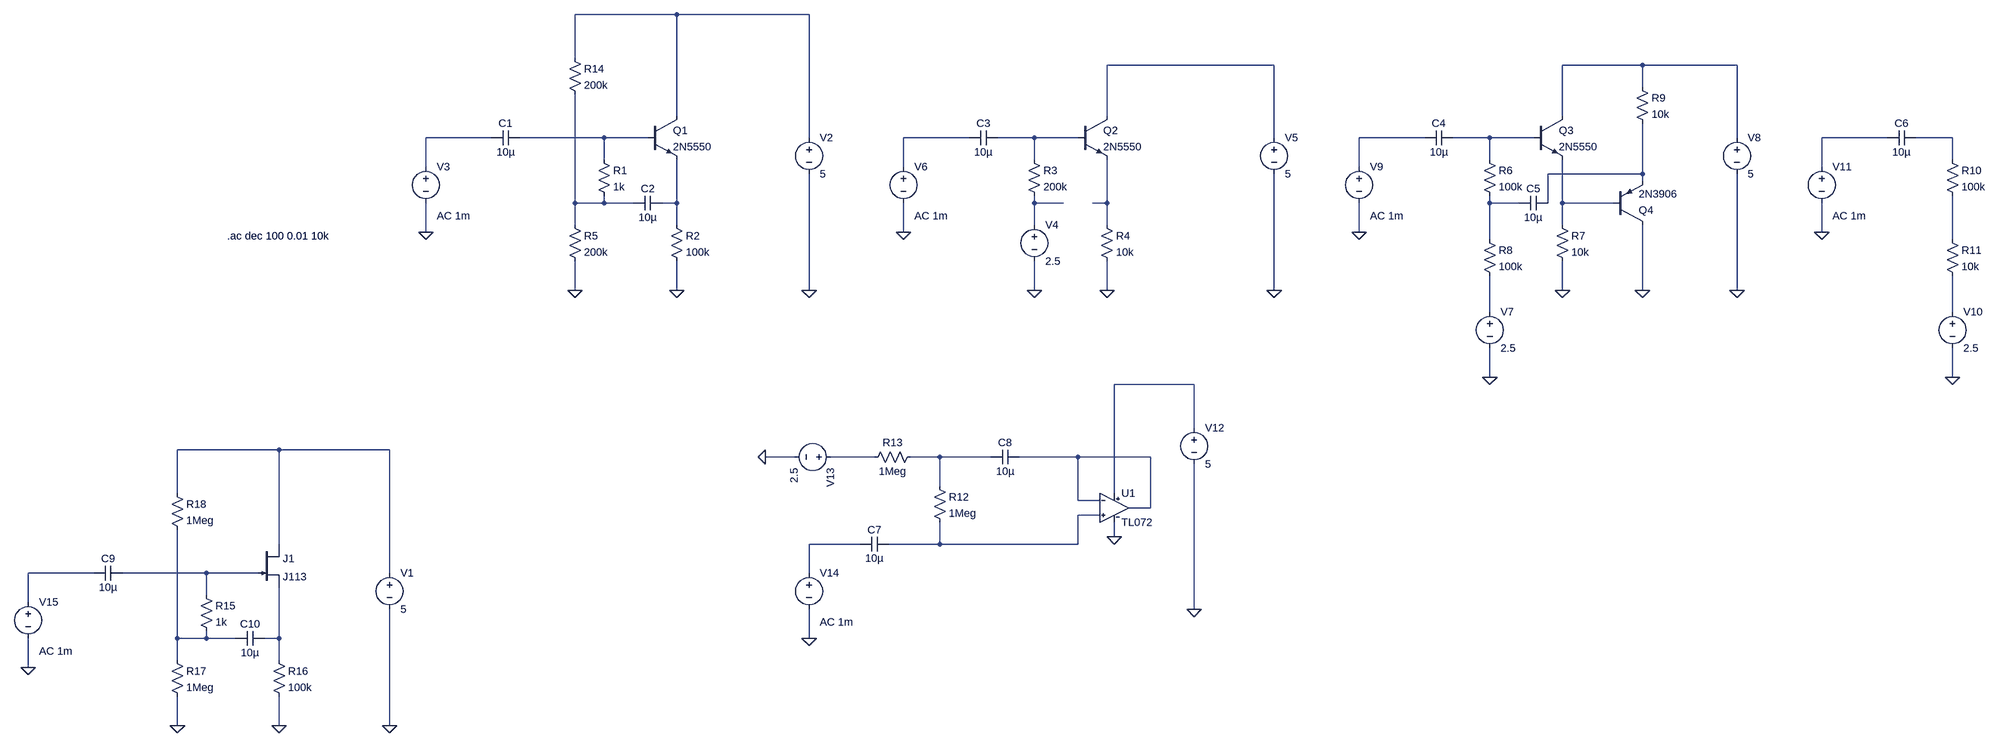
[diagram p0: schematic bootstrapped_input.asc]
bootstrapped_input.asc, the LTspice schematic file:
Version 4
SHEET 1 3344 1524
WIRE 208 -64 -16 -64
WIRE 576 -64 208 -64
WIRE -16 32 -16 -64
WIRE 1600 48 1232 48
WIRE 2416 48 2240 48
WIRE 2736 48 2416 48
WIRE 2416 96 2416 48
WIRE 208 160 208 -64
WIRE 1232 160 1232 48
WIRE 2240 160 2240 48
WIRE -224 208 -368 208
WIRE 48 208 -160 208
WIRE 144 208 48 208
WIRE 576 208 576 -64
WIRE 928 208 784 208
WIRE 1072 208 992 208
WIRE 1168 208 1072 208
WIRE 1600 208 1600 48
WIRE 1936 208 1792 208
WIRE 2080 208 2000 208
WIRE 2176 208 2080 208
WIRE 2736 208 2736 48
WIRE 3120 208 2976 208
WIRE 3264 208 3184 208
WIRE 48 256 48 208
WIRE 1072 256 1072 208
WIRE 2080 256 2080 208
WIRE 3264 256 3264 208
WIRE -368 272 -368 208
WIRE 784 272 784 208
WIRE 1792 272 1792 208
WIRE 2976 272 2976 208
WIRE 2416 288 2416 176
WIRE 2416 288 2208 288
WIRE 2416 304 2416 288
WIRE -16 352 -16 112
WIRE 48 352 48 336
WIRE 48 352 -16 352
WIRE 112 352 48 352
WIRE 208 352 208 256
WIRE 208 352 176 352
WIRE 1072 352 1072 336
WIRE 1136 352 1072 352
WIRE 1232 352 1232 256
WIRE 1232 352 1200 352
WIRE 2080 352 2080 336
WIRE 2144 352 2080 352
WIRE 2208 352 2208 288
WIRE 2240 352 2240 256
WIRE 2352 352 2240 352
WIRE -16 400 -16 352
WIRE 208 400 208 352
WIRE 1072 400 1072 352
WIRE 1232 400 1232 352
WIRE 2240 400 2240 352
WIRE -368 416 -368 352
WIRE 784 416 784 352
WIRE 1792 416 1792 352
WIRE 2976 416 2976 352
WIRE 2080 432 2080 352
WIRE 3264 432 3264 336
WIRE -16 544 -16 480
WIRE 208 544 208 480
WIRE 576 544 576 288
WIRE 1072 544 1072 480
WIRE 1232 544 1232 480
WIRE 1600 544 1600 288
WIRE 2240 544 2240 480
WIRE 2416 544 2416 400
WIRE 2736 544 2736 288
WIRE 2080 592 2080 512
WIRE 3264 592 3264 512
WIRE 2080 736 2080 672
WIRE 3264 736 3264 672
WIRE 1424 752 1248 752
WIRE 1424 848 1424 752
WIRE -816 896 -1040 896
WIRE -448 896 -816 896
WIRE 544 912 480 912
WIRE 720 912 624 912
WIRE 864 912 800 912
WIRE 976 912 864 912
WIRE 1168 912 1040 912
WIRE 1328 912 1168 912
WIRE 864 976 864 912
WIRE -1040 992 -1040 896
WIRE 1248 992 1248 752
WIRE 1168 1008 1168 912
WIRE 1216 1008 1168 1008
WIRE 1328 1024 1328 912
WIRE 1328 1024 1280 1024
WIRE 1216 1040 1168 1040
WIRE 1248 1088 1248 1056
WIRE -816 1104 -816 896
WIRE 688 1104 576 1104
WIRE 864 1104 864 1056
WIRE 864 1104 752 1104
WIRE 1168 1104 1168 1040
WIRE 1168 1104 864 1104
WIRE -1248 1168 -1392 1168
WIRE -976 1168 -1184 1168
WIRE -864 1168 -976 1168
WIRE -448 1168 -448 896
WIRE 576 1168 576 1104
WIRE -976 1216 -976 1168
WIRE -1392 1232 -1392 1168
WIRE 1424 1248 1424 928
WIRE -1040 1312 -1040 1072
WIRE -976 1312 -976 1296
WIRE -976 1312 -1040 1312
WIRE -912 1312 -976 1312
WIRE -816 1312 -816 1200
WIRE -816 1312 -848 1312
WIRE 576 1312 576 1248
WIRE -1040 1360 -1040 1312
WIRE -816 1360 -816 1312
WIRE -1392 1376 -1392 1312
WIRE -1040 1504 -1040 1440
WIRE -816 1504 -816 1440
WIRE -448 1504 -448 1248
FLAG -368 416 0
FLAG 208 544 0
FLAG 576 544 0
FLAG 784 416 0
FLAG 1072 544 0
FLAG 1232 544 0
FLAG 1600 544 0
FLAG 1792 416 0
FLAG 2080 736 0
FLAG 2240 544 0
FLAG 2736 544 0
FLAG 2416 544 0
FLAG 2976 416 0
FLAG 3264 736 0
FLAG 1424 1248 0
FLAG 1248 1088 0
FLAG 480 912 0
FLAG 576 1312 0
FLAG -16 544 0
FLAG -1392 1376 0
FLAG -816 1504 0
FLAG -448 1504 0
FLAG -1040 1504 0
SYMBOL npn 144 160 R0
SYMATTR InstName Q1
SYMATTR Value 2N5550
SYMBOL cap -160 192 R90
WINDOW 0 0 32 VBottom 2
WINDOW 3 32 32 VTop 2
SYMATTR InstName C1
SYMATTR Value 10µ
SYMBOL res 32 240 R0
SYMATTR InstName R1
SYMATTR Value 1k
SYMBOL voltage 576 192 R0
WINDOW 123 0 0 Left 0
WINDOW 39 0 0 Left 0
SYMATTR InstName V2
SYMATTR Value 5
SYMBOL voltage -368 256 R0
WINDOW 123 24 124 Left 2
WINDOW 39 0 0 Left 0
SYMATTR InstName V3
SYMATTR Value ""
SYMATTR Value2 AC 1m
SYMBOL cap 176 336 R90
WINDOW 0 0 32 VBottom 2
WINDOW 3 32 32 VTop 2
SYMATTR InstName C2
SYMATTR Value 10µ
SYMBOL res 192 384 R0
SYMATTR InstName R2
SYMATTR Value 100k
SYMBOL npn 1168 160 R0
SYMATTR InstName Q2
SYMATTR Value 2N5550
SYMBOL cap 992 192 R90
WINDOW 0 0 32 VBottom 2
WINDOW 3 32 32 VTop 2
SYMATTR InstName C3
SYMATTR Value 10µ
SYMBOL res 1056 240 R0
SYMATTR InstName R3
SYMATTR Value 200k
SYMBOL voltage 1072 384 R0
WINDOW 123 0 0 Left 0
WINDOW 39 0 0 Left 0
SYMATTR InstName V4
SYMATTR Value 2.5
SYMBOL voltage 1600 192 R0
WINDOW 123 0 0 Left 0
WINDOW 39 0 0 Left 0
SYMATTR InstName V5
SYMATTR Value 5
SYMBOL voltage 784 256 R0
WINDOW 123 24 124 Left 2
WINDOW 39 0 0 Left 0
SYMATTR InstName V6
SYMATTR Value ""
SYMATTR Value2 AC 1m
SYMBOL res 1216 384 R0
SYMATTR InstName R4
SYMATTR Value 10k
SYMBOL res -32 384 R0
SYMATTR InstName R5
SYMATTR Value 200k
SYMBOL npn 2176 160 R0
SYMATTR InstName Q3
SYMATTR Value 2N5550
SYMBOL cap 2000 192 R90
WINDOW 0 0 32 VBottom 2
WINDOW 3 32 32 VTop 2
SYMATTR InstName C4
SYMATTR Value 10µ
SYMBOL res 2064 240 R0
SYMATTR InstName R6
SYMATTR Value 100k
SYMBOL voltage 2080 576 R0
WINDOW 123 0 0 Left 0
WINDOW 39 0 0 Left 0
SYMATTR InstName V7
SYMATTR Value 2.5
SYMBOL voltage 2736 192 R0
WINDOW 123 0 0 Left 0
WINDOW 39 0 0 Left 0
SYMATTR InstName V8
SYMATTR Value 5
SYMBOL voltage 1792 256 R0
WINDOW 123 24 124 Left 2
WINDOW 39 0 0 Left 0
SYMATTR InstName V9
SYMATTR Value ""
SYMATTR Value2 AC 1m
SYMBOL cap 2208 336 R90
WINDOW 0 0 32 VBottom 2
WINDOW 3 32 32 VTop 2
SYMATTR InstName C5
SYMATTR Value 10µ
SYMBOL res 2224 384 R0
SYMATTR InstName R7
SYMATTR Value 10k
SYMBOL res 2064 416 R0
SYMATTR InstName R8
SYMATTR Value 100k
SYMBOL pnp 2352 400 M180
SYMATTR InstName Q4
SYMATTR Value 2N3906
SYMBOL res 2400 80 R0
SYMATTR InstName R9
SYMATTR Value 10k
SYMBOL cap 3184 192 R90
WINDOW 0 0 32 VBottom 2
WINDOW 3 32 32 VTop 2
SYMATTR InstName C6
SYMATTR Value 10µ
SYMBOL res 3248 240 R0
SYMATTR InstName R10
SYMATTR Value 100k
SYMBOL voltage 3264 576 R0
WINDOW 123 0 0 Left 0
WINDOW 39 0 0 Left 0
SYMATTR InstName V10
SYMATTR Value 2.5
SYMBOL voltage 2976 256 R0
WINDOW 123 24 124 Left 2
WINDOW 39 0 0 Left 0
SYMATTR InstName V11
SYMATTR Value ""
SYMATTR Value2 AC 1m
SYMBOL res 3248 416 R0
SYMATTR InstName R11
SYMATTR Value 10k
SYMBOL ZZZ\\OpAmp\\TL072 1248 1024 R0
SYMATTR InstName U1
SYMBOL voltage 1424 832 R0
WINDOW 123 0 0 Left 0
WINDOW 39 0 0 Left 0
SYMATTR InstName V12
SYMATTR Value 5
SYMBOL res 848 960 R0
SYMATTR InstName R12
SYMATTR Value 1Meg
SYMBOL cap 752 1088 R90
WINDOW 0 0 32 VBottom 2
WINDOW 3 32 32 VTop 2
SYMATTR InstName C7
SYMATTR Value 10µ
SYMBOL cap 1040 896 R90
WINDOW 0 0 32 VBottom 2
WINDOW 3 32 32 VTop 2
SYMATTR InstName C8
SYMATTR Value 10µ
SYMBOL voltage 640 912 R90
WINDOW 123 0 0 Left 0
WINDOW 39 0 0 Left 0
SYMATTR InstName V13
SYMATTR Value 2.5
SYMBOL voltage 576 1152 R0
WINDOW 123 24 124 Left 2
WINDOW 39 0 0 Left 0
SYMATTR InstName V14
SYMATTR Value ""
SYMATTR Value2 AC 1m
SYMBOL res 816 896 R90
WINDOW 0 0 56 VBottom 2
WINDOW 3 32 56 VTop 2
SYMATTR InstName R13
SYMATTR Value 1Meg
SYMBOL res -32 16 R0
SYMATTR InstName R14
SYMATTR Value 200k
SYMBOL cap -1184 1152 R90
WINDOW 0 0 32 VBottom 2
WINDOW 3 32 32 VTop 2
SYMATTR InstName C9
SYMATTR Value 10µ
SYMBOL res -992 1200 R0
SYMATTR InstName R15
SYMATTR Value 1k
SYMBOL voltage -448 1152 R0
WINDOW 123 0 0 Left 0
WINDOW 39 0 0 Left 0
SYMATTR InstName V1
SYMATTR Value 5
SYMBOL voltage -1392 1216 R0
WINDOW 123 24 124 Left 2
WINDOW 39 0 0 Left 0
SYMATTR InstName V15
SYMATTR Value ""
SYMATTR Value2 AC 1m
SYMBOL cap -848 1296 R90
WINDOW 0 0 32 VBottom 2
WINDOW 3 32 32 VTop 2
SYMATTR InstName C10
SYMATTR Value 10µ
SYMBOL res -832 1344 R0
SYMATTR InstName R16
SYMATTR Value 100k
SYMBOL res -1056 1344 R0
SYMATTR InstName R17
SYMATTR Value 1Meg
SYMBOL res -1056 976 R0
SYMATTR InstName R18
SYMATTR Value 1Meg
SYMBOL njf -864 1104 R0
SYMATTR InstName J1
SYMATTR Value J113
TEXT -930 424 Left 2 !.ac dec 100 0.01 10k

The netlist it stands for:
* bootstrapped_input.asc
Q1 N001 N005 N014 0 2N5550
C1 N005 N004 10µ
R1 N005 N013 1k
V2 N001 0 5
V3 N004 0 AC 1m
C2 N014 N013 10µ
R2 N014 0 100k
Q2 N002 N007 N016 0 2N5550
C3 N007 N006 10µ
R3 N007 N015 200k
V4 N015 0 2.5
V5 N002 0 5
V6 N006 0 AC 1m
R4 N016 0 10k
R5 N013 0 200k
Q3 N003 N009 N018 0 2N5550
C4 N009 N008 10µ
R6 N009 N017 100k
V7 N020 0 2.5
V8 N003 0 5
V9 N008 0 AC 1m
C5 N012 N017 10µ
R7 N018 0 10k
R8 N017 N020 100k
Q4 0 N018 N012 0 2N3906
R9 N003 N012 10k
C6 N011 N010 10µ
R10 N011 N019 100k
V10 N021 0 2.5
V11 N010 0 AC 1m
R11 N019 N021 10k
XU1 N027 N026 N022 0 N026 TL072  ; pins 1 2 3 4 5
V12 N022 0 5
R12 N025 N027 1Meg
C7 N027 N028 10µ
C8 N026 N025 10µ
V13 N024 0 2.5
V14 N028 0 AC 1m
R13 N025 N024 1Meg
R14 N001 N013 200k
C9 N030 N029 10µ
R15 N030 N031 1k
V1 N023 0 5
V15 N029 0 AC 1m
C10 N032 N031 10µ
R16 N032 0 100k
R17 N031 0 1Meg
R18 N023 N031 1Meg
J1 N023 N030 N032 J113
.model NPN NPN
.model PNP PNP
.lib standard.bjt
.model NJF NJF
.model PJF PJF
.lib standard.jft
.ac dec 100 0.01 10k
.lib TL072.cir
.backanno
.end